# Altium project Memory_Expansion_Daughter_Board.PrjPCB (part 1 of 2)
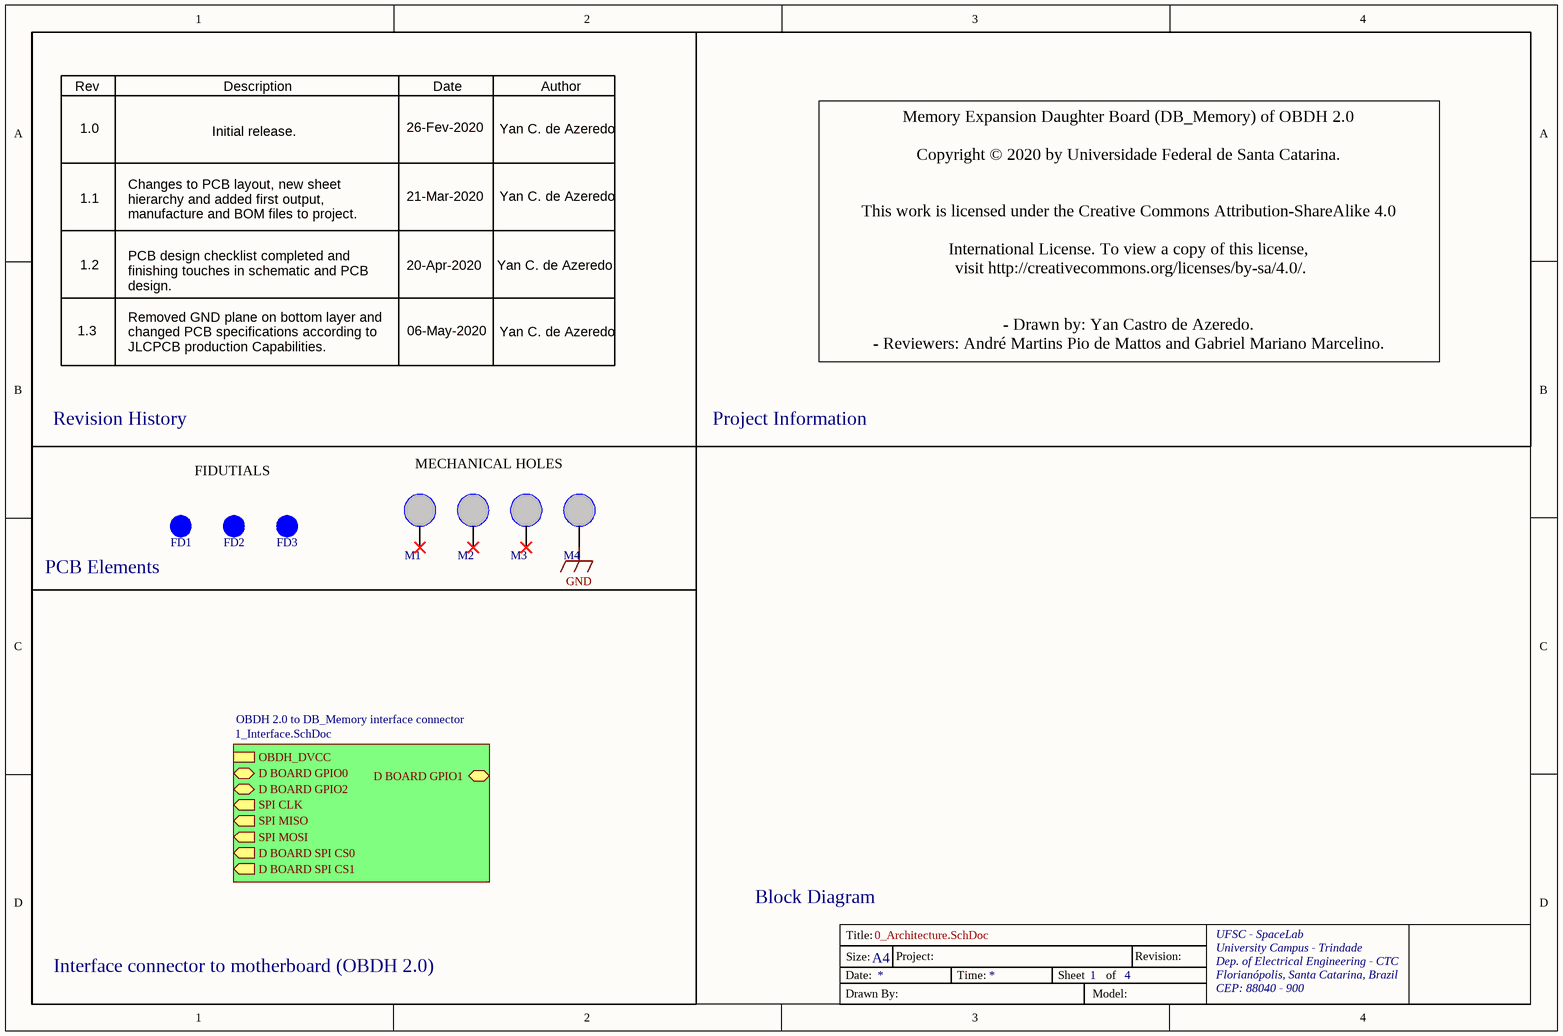
[diagram p0: 0_Architecture.SchDoc]
4 sheets, 45 parts. Net scope: hierarchical (ports join the sheet entries above them; power ports are global).
Board file: Memory_Expansion_Daughter_Board.PcbDoc
Sheets:
  0_Architecture.SchDoc
    OBDH 2.0 to DB_Memory interface connector = 1_Interface.SchDoc
      U_2_Non_Volatile_Memories = 2_Non_Volatile_Memories.SchDoc
      U_3_Communication_Buffers = 3_Communication_Buffers.SchDoc

## Sheet 0_Architecture.SchDoc
size A4; Organization: SpaceLab UFSC; Address1: UFSC - SpaceLab; Address2: University Campus - Trindade; Address3: Dep. of Electrical Engineering - CTC; Address4: Florianópolis, Santa Catarina, Brazil; DocumentNumber: 1; SheetNumber: 1; SheetTotal: 4; Address5: CEP: 88040 - 900

### Parts
FD1  Fiducial  [Fiducial 1.3mm]  (value not drawn)  (no BOM)
FD2  Fiducial  [Fiducial 1.3mm]  (value not drawn)  (no BOM)
FD3  Fiducial  [Fiducial 1.3mm]  (value not drawn)  (no BOM)
M1  DB Mechanical Hole  [DB Mechanical Hole]  (value not drawn)  (no BOM)
M2  DB Mechanical Hole  [DB Mechanical Hole]  (value not drawn)  (no BOM)
M3  DB Mechanical Hole  [DB Mechanical Hole]  (value not drawn)  (no BOM)
M4  DB Mechanical Hole  [DB Mechanical Hole]  (value not drawn)  (no BOM)

### Sub-sheets
OBDH 2.0 to DB_Memory interface connector = 1_Interface.SchDoc: OBDH_DVCC, D BOARD SPI CS1 (out), D BOARD SPI CS0 (out), SPI CLK (out), SPI MISO (out), D BOARD GPIO2 (bidir), D BOARD GPIO0 (bidir), SPI MOSI (out), D BOARD GPIO1 (bidir)

### Nets
GND: M4.0

Not connected (* = marked no-connect by the designer): M1 0*; M2 0*; M3 0*

### Notes on the sheet
- Rev
- Description
- Date
- Author
- 1.0
- Initial release.
- 26-Fev-2020
- Yan C. de Azeredo
- 1.1
- Changes to PCB layout, new sheet hierarchy and added first output, manufacture and BOM files to project.
- 21-Mar-2020
- 1.2
- PCB design checklist completed and finishing touches in schematic and PCB design.
- 20-Apr-2020
- 1.3
- Removed GND plane on bottom layer and changed PCB specifications according to JLCPCB production Capabilities.
- 06-May-2020
- Memory Expansion Daughter Board (DB_Memory) of OBDH 2.0
  Copyright © 2020 by Universidade Federal de Santa Catarina.
  This work is licensed under the Creative Commons Attribution-ShareAlike 4.0
  International License. To view a copy of this license,
  visit http://creativecommons.org/licenses/by-sa/4.0/.
  - Drawn by: Yan Castro de Azeredo.
  - Reviewers: André Martins Pio de Mattos and Gabriel Mariano Marcelino.
  - Based on OBDH 2.0 designed by: André Martins Pio de Mattos.
  - Support: Kleber Reis Gouveia Júnior.
- Revision History
- Project Information
- FIDUTIALS
- MECHANICAL HOLES
- (near FD1) PCB Elements
- Block Diagram
- Interface connector to motherboard (OBDH 2.0)
- Date:
- Title:
- Size:
- A4
- Project:
- Time:
- Sheet
- of
- Revision:
- UFSC - SpaceLab
- University Campus - Trindade
- Dep. of Electrical Engineering - CTC
- Florianópolis, Santa Catarina, Brazil
- CEP: 88040 - 900
- Drawn By:
- Model:

### Library data of the parts
FD1-FD3 = Fiducial: Fiducial for DB board variants
M1-M4 = DB Mechanical Hole: Mechanical Hole for DB board variants

## Sheet 1_Interface.SchDoc
size A4; Organization: SpaceLab UFSC; Address1: UFSC - SpaceLab; Address2: University Campus - Trindade; Address3: Dep. of Electrical Engineering - CTC; Address4: Florianópolis, Santa Catarina, Brazil; Address5: CEP: 88040 - 900
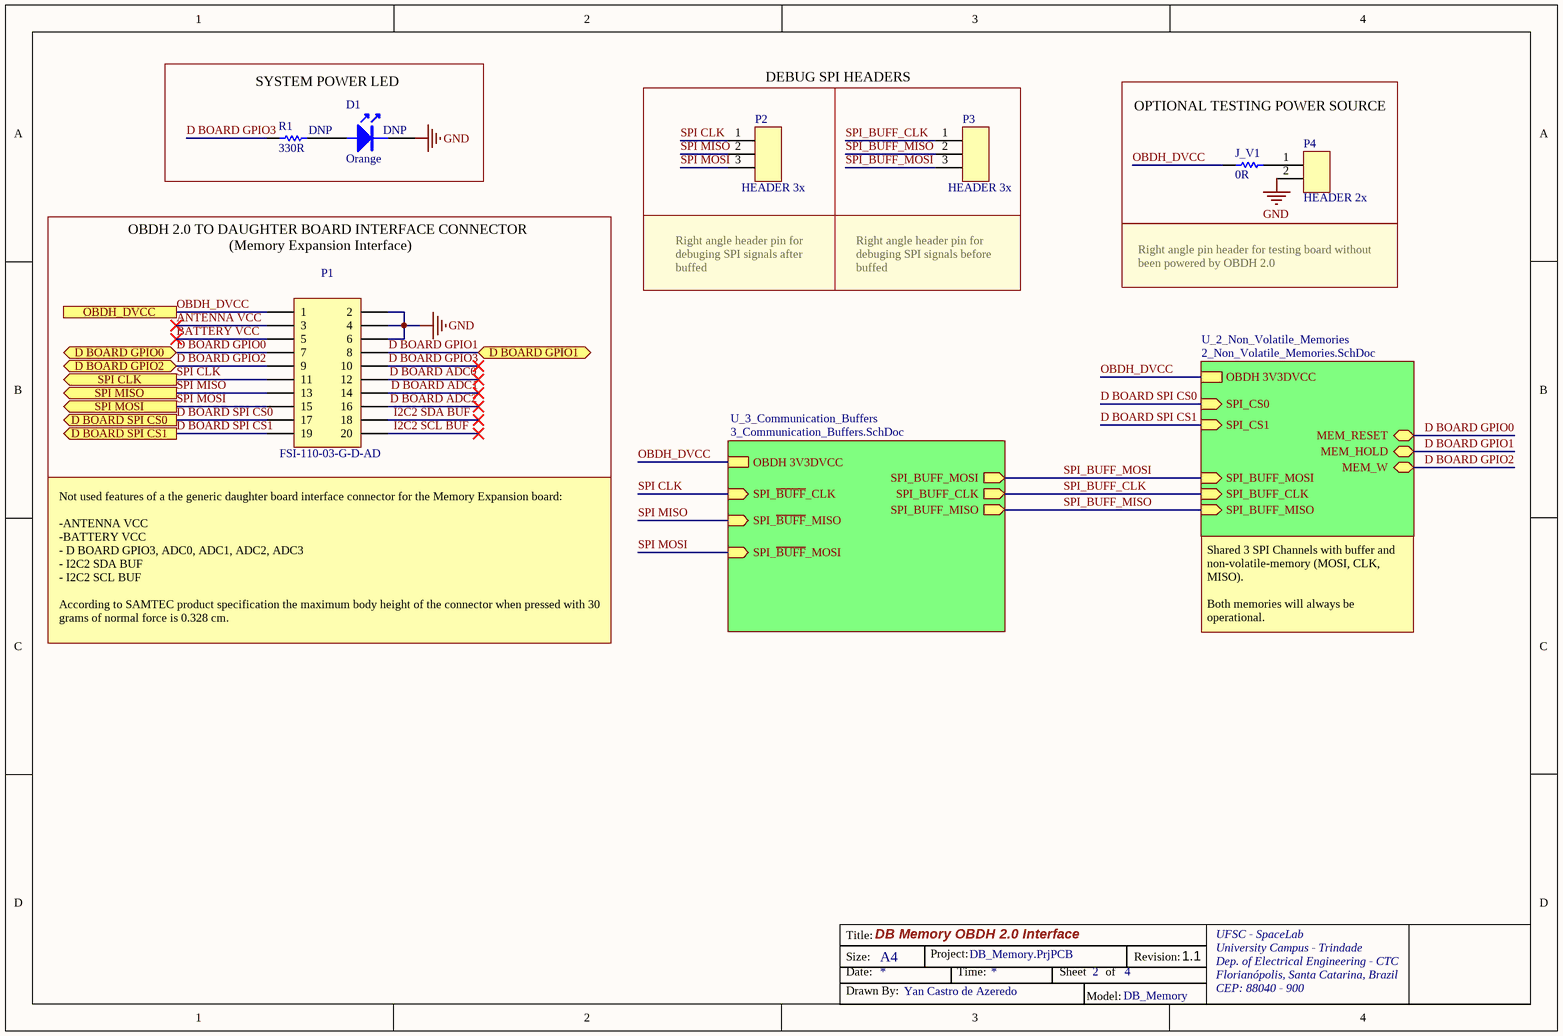
[diagram p1: 1_Interface.SchDoc]

### Parts
D1  Orange  [0805-LED]
J_V1  0R  [0805]
P1  FSI-110-03-G-D-AD  [Mating FSI-110-03-G-D-AD]
P2  HEADER 3x  [Header1x3]
P3  HEADER 3x  [Header1x3]
P4  HEADER 2x  [HEADER 1X2]
R1  330R  [0805]

### Blocks framed on the sheet
SYSTEM POWER LED: D1 R1
OPTIONAL TESTING POWER SOURCE: J_V1 P4
DEBUG SPI HEADERS: P2 P3

### Sub-sheets
U_2_Non_Volatile_Memories = 2_Non_Volatile_Memories.SchDoc: SPI_CS1 (in), SPI_CS0 (in), MEM_RESET (bidir), MEM_HOLD (bidir), MEM_W (bidir), SPI_BUFF_MOSI (in), SPI_BUFF_CLK (in), SPI_BUFF_MISO (in), OBDH 3V3DVCC
U_3_Communication_Buffers = 3_Communication_Buffers.SchDoc: SPI_BUFF_MOSI (out), SPI_BUFF_CLK (out), SPI_BUFF_MISO (out), SPI_~{BUFF}_MISO (in), SPI_~{BUFF}_CLK (in), SPI_~{BUFF}_MOSI (in), OBDH 3V3DVCC

### Ports
D BOARD GPIO0 (bidir), D BOARD GPIO1 (bidir), D BOARD GPIO2 (bidir), D BOARD SPI CS0 (out), D BOARD SPI CS1 (out), OBDH_DVCC, SPI CLK (out), SPI MISO (out), SPI MOSI (out)

### Nets
GND: D1.2(K) P1.2 P1.4 P1.6 P4.2
OBDH_DVCC: J_V1.2 P1.1 ; port OBDH_DVCC, sheet U_2_Non_Volatile_Memories/OBDH 3V3DVCC, sheet U_3_Communication_Buffers/OBDH 3V3DVCC  [project net OBDH 3V3DVCC]
ANTENNA VCC: P1.3
BATTERY VCC: P1.5
D BOARD ADC0: P1.12
D BOARD ADC1: P1.14
D BOARD ADC2: P1.16
D BOARD GPIO0: P1.7 ; port D BOARD GPIO0, sheet U_2_Non_Volatile_Memories/MEM_RESET
D BOARD GPIO1: P1.8 ; port D BOARD GPIO1, sheet U_2_Non_Volatile_Memories/MEM_HOLD
D BOARD GPIO2: P1.9 ; port D BOARD GPIO2, sheet U_2_Non_Volatile_Memories/MEM_W
D BOARD GPIO3: P1.10 R1.1
D BOARD SPI CS0: P1.17 ; port D BOARD SPI CS0, sheet U_2_Non_Volatile_Memories/SPI_CS0
D BOARD SPI CS1: P1.19 ; port D BOARD SPI CS1, sheet U_2_Non_Volatile_Memories/SPI_CS1
I2C2 SCL BUF: P1.20
I2C2 SDA BUF: P1.18
SPI CLK: P1.11 P2.1 ; port SPI CLK, sheet U_3_Communication_Buffers/SPI_~{BUFF}_CLK
SPI MISO: P1.13 P2.2 ; port SPI MISO, sheet U_3_Communication_Buffers/SPI_~{BUFF}_MISO
SPI MOSI: P1.15 P2.3 ; port SPI MOSI, sheet U_3_Communication_Buffers/SPI_~{BUFF}_MOSI
SPI_BUFF_CLK: P3.1 ; sheet U_2_Non_Volatile_Memories/SPI_BUFF_CLK, sheet U_3_Communication_Buffers/SPI_BUFF_CLK
SPI_BUFF_MISO: P3.2 ; sheet U_2_Non_Volatile_Memories/SPI_BUFF_MISO, sheet U_3_Communication_Buffers/SPI_BUFF_MISO
SPI_BUFF_MOSI: P3.3 ; sheet U_2_Non_Volatile_Memories/SPI_BUFF_MOSI, sheet U_3_Communication_Buffers/SPI_BUFF_MOSI
NetD1_1: D1.1(A) R1.2
NetJ_V1_1: J_V1.1 P4.1

### Notes on the sheet
- (near R1) DNP
- (near D1) DNP
- OBDH 2.0 TO DAUGHTER BOARD INTERFACE CONNECTOR
- (Memory Expansion Interface)
- Right angle header pin for debuging SPI signals after buffed
- Right angle header pin for debuging SPI signals before buffed
- Right angle pin header for testing board without been powered by OBDH 2.0
- Not used features of a the generic daughter board interface connector for the Memory Expansion board:
  -ANTENNA VCC
  -BATTERY VCC
  - D BOARD GPIO3, ADC0, ADC1, ADC2, ADC3
  - I2C2 SDA BUF
  - I2C2 SCL BUF
  According to SAMTEC product specification the maximum body height of the connector when pressed with 30 grams of normal force is 0.328 cm.
- Shared 3 SPI Channels with buffer and non-volatile-memory (MOSI, CLK, MISO).
  Both memories will always be operational.
- DB Memory OBDH 2.0 Interface
- DB_Memory.PrjPCB
- 2
- 4
- 1.1
- Yan Castro de Azeredo
- DB_Memory
- Title:
- Size:
- Date:
- A4
- Project:
- Time:
- Sheet
- of
- Revision:
- UFSC - SpaceLab
- University Campus - Trindade
- Dep. of Electrical Engineering - CTC
- Florianópolis, Santa Catarina, Brazil
- CEP: 88040 - 900
- Drawn By:
- Model:

### Library data of the parts
D1 = LED/O_0802: SMD Orange LED; Partnumber: LTST-C170KFKT; Manufacturer: Vishay Lite-On; Dominant Wavelength: 605nm; Forward Current: 30mA; Forward Voltage: 2V; Lens Color: Colorless; Lens Style: Diffused,Colorless,Rectangular,Clear; Lens Transparency: Clear; Luminous Intensity: 60mcd; Number of Elements: 1; Power Dissipation: 75mW; Reverse Voltage: 5V; Test Current: 20mA; Viewing Angle: 130°; Wavelength: 611nm; NCM: 8541.40.21; ComponentLink1Description: https://www.digikey.com/product-detail/en/lite-on-inc/LTST-C170KFKT/160-1413-1-ND/386774; ComponentLink1URL: https://www.digikey.com/product-detail/en/lite-on-inc/LTST-C170KFKT/160-1413-1-ND/386774; ComponentLink2Description: https://br.mouser.com/ProductDetail/Lite-On/LTST-C170KFKT?qs=%2Fha2pyFadugHsX7bdQzWjMrioqtf8F%2FEFUVxYkqdVx%252BrRWuVMVludQ%3D%3D; ComponentLink2URL: https://br.mouser.com/ProductDetail/Lite-On/LTST-C170KFKT?qs=%2Fha2pyFadugHsX7bdQzWjMrioqtf8F%2FEFUVxYkqdVx%252BrRWuVMVludQ%3D%3D; Case/Package: 0805; Case Code (Imperial): 0805; Case Code (Metric): 2012; Color: Orange; ComponentLink3Description: https://www.verical.com/server-webapp/html/getDatasheet?partID=158266&src-supplier=Verical; ComponentLink3URL: https://www.verical.com/server-webapp/html/getDatasheet?partID=158266&src-supplier=Verical; ComponentLink4Description: http://optoelectronics.liteon.com/upload/download/DS-22-99-0185/LTST-C170KFKT.pdf?src-supplier=Digi-Key; ComponentLink4URL: http://optoelectronics.liteon.com/upload/download/DS-22-99-0185/LTST-C170KFKT.pdf?src-supplier=Digi-Key; ComponentLink5Description: http://www1.futureelectronics.com/doc/LITE-ON/LTST-C170KFKT.pdf?src-supplier=Future+Electronics; ComponentLink5URL: http://www1.futureelectronics.com/doc/LITE-ON/LTST-C170KFKT.pdf?src-supplier=Future+Electronics; ComponentLink6Description: http://www.mouser.com/ds/2/239/Lite-On-LTST-C170KFKT-187690.pdf?src-supplier=Mouser; ComponentLink6URL: http://www.mouser.com/ds/2/239/Lite-On-LTST-C170KFKT-187690.pdf?src-supplier=Mouser; Depth: 1.6mm; Height: 1.1mm; Illumination Color: Orange; Lead Free: Lead Free; Length: 3.2mm; Manufacturer Part Number: LTST-C170KFKT; Max Operating Temperature: 85°C; Min Operating Temperature: -55°C; Mount: Surface Mount; Number of LEDs: 1; Number of Pins: 2; Package Quantity: 1; Packaging: Tape and Reel; Power Rating: 75mW; Pricing 1: 1=0.28, 10=0.204, 100=0.0968, 500=0.0645, 1000=0.05053 (USD); Pricing 2: 1=0.28, 10=0.15, 100=0.07, 1000=0.051, 3000=0.043, 9000=0.039, 24000=0.035, 45000=0.032, 99000=0.03 (USD); Radiation Hardening: No; Stock 1: 5261; Stock 2: 0; Supplier 1: Digi-Key; Supplier 2: Mouser; Supplier Part Number 1: 160-1413-1-ND; Supplier Part Number 2: 859-LTST-C170KFKT; Width: 1.25mm
J_V1 = RC0805JR-070RL: RES 0R OHM 1/8W JUMPER 0805; Partnumber: CRCW08050000Z0EA; Manufacturer: Yageo; Resistance: 0mR; Tolerance: 5%; Power Rating: 125mW; Voltage Rating: 150V; Temperature Coefficient: 200ppm/°C; NCM: 8533.21.20; Supplier 1: Digi-Key; Supplier Part Number 1: 311-0.0ARCT-ND; Stock 1: 10579520; Pricing 1: 1=0.1, 10=0.035, 25=0.0248, 50=0.019, 100=0.014, 250=0.01072, 500=0.00856, 1000=0.00631 (USD); Case/Package: 0805; Number of Pins: 2; Contact Plating: Tin,Matte; Case Code (Imperial): 0805; Case Code (Metric): 2012; Min Operating Temperature: -55°C; Max Operating Temperature: 155°C; Composition: Thick Film; Packaging: Tape and Reel; Voltage Rating (DC): 150V; Termination: SMD/SMT; Military Standard: Not; Length: 2mm; Height: 0.5mm; Width: 1.25mm; Depth: 1.25mm; Radiation Hardening: No; REACH SVHC: Unknown; Lead Free: Lead Free; ComponentLink1URL: http://www.farnell.com/datasheets/2167052.pdf?src-supplier=Element14; ComponentLink1Description: http://www.farnell.com/datasheets/2167052.pdf?src-supplier=Element14; ComponentLink2URL: http://documents.rs-components.com/techlib://itc_doclist_GB.htm?stockno=6185129&src-supplier=RSComponents; ComponentLink2Description: http://documents.rs-components.com/techlib://itc_doclist_GB.htm?stockno=6185129&src-supplier=RSComponents; ComponentLink3URL: https://www.verical.com/server-webapp/html/getDatasheet?partID=330685&src-supplier=Verical; ComponentLink3Description: https://www.verical.com/server-webapp/html/getDatasheet?partID=330685&src-supplier=Verical; Supplier 2: Mouser; Supplier Part Number 2: 603-RC0805JR-070RL; Stock 2: 658275; Pricing 2: 1=0.1, 10=0.005, 100=0.005, 1000=0.005, 5000=0.004, 10000=0.004 (USD); Manufacturer Part Number: RC0805JR-070RL
P1 = FSI-110-03-G-D-AD: CONN STACKING 20POS SMD GOLD; Manufacturer: Samtec; Gender: Male; Number of Contacts: 20; Pitch: 1mm; Value: *; Partnumber: FSI-110-03-G-D-AD; ComponentLink1Description: https://www.digikey.com/product-detail/en/samtec-inc/FSI-110-03-G-D-AD/SAM9412-ND/6678149; ComponentLink1URL: https://www.digikey.com/product-detail/en/samtec-inc/FSI-110-03-G-D-AD/SAM9412-ND/6678149; ComponentLink2Description: https://br.mouser.com/ProductDetail/Samtec/FSI-110-03-G-D-AD?qs=sGAEpiMZZMvffgRu4KC1RxM6nKwEP14AvPoIU%2FGiIRnIunfAN0MvNQ%3D%3D; ComponentLink2URL: https://br.mouser.com/ProductDetail/Samtec/FSI-110-03-G-D-AD?qs=sGAEpiMZZMvffgRu4KC1RxM6nKwEP14AvPoIU%2FGiIRnIunfAN0MvNQ%3D%3D; ComponentLink3Description: http://www.samtec.com/ftppub/pdf/FSI_03.PDF?src-supplier=Avnet+Europe; ComponentLink3URL: http://www.samtec.com/ftppub/pdf/FSI_03.PDF?src-supplier=Avnet+Europe; Contact Material: Copper; Contact Plating: Gold; Manufacturer Part Number: FSI-110-03-G-D-AD; Mount: Surface Mount; Number of Rows: 2; Pricing 1: 1=6.6, 10=6.325, 25=5.7752, 50=5.5, 100=5.225, 250=4.675, 500=4.4, 1000=3.85, 2500=3.6575 (USD); Pricing 2: 1=6.59, 10=5.5, 100=4.68, 250=4.17, 500=3.84, 1000=3.6 (USD); Radiation Hardening: No; REACH SVHC: No SVHC; Stock 1: 100; Stock 2: 50; Supplier 1: Digi-Key; Supplier 2: Mouser; Supplier Part Number 1: SAM9412-ND; Supplier Part Number 2: 200-FSI11003GDAD; Termination: Solder
P2 P3 = HEADER 3x: Conn Unshrouded Header HDR 3 POS 2.54mm Solder RA Thru-Hole Automotive Bulk; Manufacturer: Samtec; Manufacturer Part Number: TSW-103-08-G-S-RA; Number of Contacts: 3; Connector Type: Male Pin; Gender: Male; Max Current Rating: 7.6A; Max Voltage Rating (AC): 450V; Supplier 1: Digi-Key; Stock 1: 2099; Pricing 1: 1=0.43, 10=0.403, 25=0.3456, 50=0.2938, 100=0.2822, 250=0.25344, 500=0.24192 (USD); Contact Plating: Gold; Contact Material: Bronze; Color: Black; Housing Color: Black; Housing Material: Polyester; Min Operating Temperature: -55°C; Max Operating Temperature: 125°C; Number of Rows: 1; Termination: Solder; Packaging: Bulk; Number of Positions: 3; Package Quantity: 1; Orientation: Right Angle; Length: 7.62mm; Pitch: 2.54mm; Depth: 9.9mm; Contact Mating Length: 0.23inch; Width: 2.54mm; Radiation Hardening: No; REACH SVHC: No SVHC; Lead Free: Lead Free; Supplier Part Number 1: SAM1039-03-ND; ComponentLink4Description: https://www.digikey.com/product-detail/en/samtec-inc/TSW-103-08-G-S-RA/SAM1039-03-ND/1101821; ComponentLink4URL: https://www.digikey.com/product-detail/en/samtec-inc/TSW-103-08-G-S-RA/SAM1039-03-ND/1101821; ComponentLink5Description: https://br.mouser.com/ProductDetail/Samtec/TSW-103-08-G-S-RA?qs=sGAEpiMZZMs%252BGHln7q6pm1g2HIpDMMemHovqpYNR5zQ9xV6Y7S0zpg%3D%3D; ComponentLink5URL: https://br.mouser.com/ProductDetail/Samtec/TSW-103-08-G-S-RA?qs=sGAEpiMZZMs%252BGHln7q6pm1g2HIpDMMemHovqpYNR5zQ9xV6Y7S0zpg%3D%3D; ComponentLink1URL: http://www.samtec.com/ftppub/pdf/htsw_th.pdf?src-supplier=Avnet+Europe; ComponentLink1Description: http://www.samtec.com/ftppub/pdf/htsw_th.pdf?src-supplier=Avnet+Europe; ComponentLink2URL: http://www.samtec.com/ftppub/pdf/htsw_th.pdf?src-supplier=Avnet; ComponentLink2Description: http://www.samtec.com/ftppub/pdf/htsw_th.pdf?src-supplier=Avnet; ComponentLink3URL: http://suddendocs.samtec.com/prints/tsw-xxx-xx-x-x-xx-xxx-footprint.pdf?src-supplier=Digi-Key; ComponentLink3Description: http://suddendocs.samtec.com/prints/tsw-xxx-xx-x-x-xx-xxx-footprint.pdf?src-supplier=Digi-Key; Supplier 2: Mouser; Supplier Part Number 2: 200-TSW10308GSRA; Stock 2: 1859; Pricing 2: 1=0.44, 10=0.303, 100=0.249, 1000=0.208, 2500=0.178, 10000=0.16 (USD)
P4 = HEADER 2x: Conn Unshrouded Header HDR 2 POS 2.54mm Solder RA Thru-Hole Automotive Bulk; Manufacturer: Samtec; Manufacturer Part Number: TSW-102-08-G-S-RA; Number of Positions: 2; Connector Type: Male Pin; Gender: Male; Max Current Rating: 7.6A; Max Voltage Rating (AC): 450V; Supplier 1: Digi-Key; Stock 1: 681; Pricing 1: 1=0.28, 10=0.269, 25=0.2304, 50=0.1958, 100=0.1882, 250=0.16896, 500=0.16128 (USD); Contact Plating: Gold; Contact Material: Bronze; Color: Black; Housing Color: Black; Housing Material: Polyester; Min Operating Temperature: -55°C; Max Operating Temperature: 125°C; Number of Rows: 1; Termination: Solder; Packaging: Bulk; Number of Contacts: 2; Orientation: Right Angle; Package Quantity: 1; Length: 5.08mm; Pitch: 2.54mm; Width: 2.54mm; Depth: 9.9mm; Contact Mating Length: 0.23inch; Radiation Hardening: No; Lead Free: Lead Free; REACH SVHC: No SVHC; ComponentLink1URL: http://www.samtec.com/ftppub/pdf/htsw_th.pdf?src-supplier=Avnet; ComponentLink1Description: http://www.samtec.com/ftppub/pdf/htsw_th.pdf?src-supplier=Avnet; ComponentLink2URL: http://suddendocs.samtec.com/prints/tsw-xxx-xx-x-x-xx-xxx-footprint.pdf?src-supplier=Digi-Key; ComponentLink2Description: http://suddendocs.samtec.com/prints/tsw-xxx-xx-x-x-xx-xxx-footprint.pdf?src-supplier=Digi-Key; Supplier Part Number 1: SAM1039-02-ND; ComponentLink3Description: https://www.digikey.com/product-detail/en/samtec-inc/TSW-102-08-G-S-RA/SAM1039-02-ND/1101822; ComponentLink3URL: https://www.digikey.com/product-detail/en/samtec-inc/TSW-102-08-G-S-RA/SAM1039-02-ND/1101822; ComponentLink4Description: https://br.mouser.com/ProductDetail/Samtec/TSW-102-08-G-S-RA?qs=sGAEpiMZZMs%252BGHln7q6pm8Vn94ktop%2FJ1uezLg%252BX1dFCcXJp94NfRw%3D%3D; ComponentLink4URL: https://br.mouser.com/ProductDetail/Samtec/TSW-102-08-G-S-RA?qs=sGAEpiMZZMs%252BGHln7q6pm8Vn94ktop%2FJ1uezLg%252BX1dFCcXJp94NfRw%3D%3D; Pricing 2: 1=0.29, 10=0.203, 100=0.167, 1000=0.14, 2500=0.119, 10000=0.108 (USD); Stock 2: 90; Supplier 2: Mouser; Supplier Part Number 2: 200-TSW10208GSRA
R1 = R330R_1%_1/4W_0805: RES 330R OHM 1/4W 1% 0805; Partnumber: RC0805FR-07330RL; Manufacturer: KOA Speer; Manufacturer Part Number: RK73H2ATTD3300F; Power Rating: 125mW; Temperature Coefficient: 100ppm/°C; Voltage Rating: 150V; NCM: 8533.21.20; Case/Package: 0805; Case Code (Imperial): 0805; Case Code (Metric): 2012; ComponentLink1Description: https://www.digikey.com/product-detail/en/koa-speer-electronics-inc/RK73H2ATTD3300F/2019-RK73H2ATTD3300FCT-ND/10235463; ComponentLink1URL: https://www.digikey.com/product-detail/en/koa-speer-electronics-inc/RK73H2ATTD3300F/2019-RK73H2ATTD3300FCT-ND/10235463; ComponentLink2Description: https://br.mouser.com/ProductDetail/KOA-Speer/RK73H2ATTD3300F?qs=%2Fha2pyFadugxRkEvlrt8CF%252BQdweyO24kpRel1WKIEPxDUp0ygGBU5A%3D%3D; ComponentLink2URL: https://br.mouser.com/ProductDetail/KOA-Speer/RK73H2ATTD3300F?qs=%2Fha2pyFadugxRkEvlrt8CF%252BQdweyO24kpRel1WKIEPxDUp0ygGBU5A%3D%3D; ComponentLink3Description: http://www.koaspeer.com/catimages/Products/RK73H/RK73H.pdf?src-supplier=Mouser; ComponentLink3URL: http://www.koaspeer.com/catimages/Products/RK73H/RK73H.pdf?src-supplier=Mouser; ComponentLink4Description: http://www.farnell.com/datasheets/1832268.pdf?src-supplier=Element14; ComponentLink4URL: http://www.farnell.com/datasheets/1832268.pdf?src-supplier=Element14; Composition: Thick Film; Depth: 1.25mm; Height: 0.5mm; Lead Free: Lead Free; Length: 2mm; Max Operating Temperature: 155°C; Military Standard: Not; Min Operating Temperature: -55°C; Package Quantity: 5000; Packaging: Tape and Reel; Pricing 1: 1=0.1, 10=0.033, 100=0.0136, 1000=0.00612, 2500=0.00531 (USD); Pricing 2: 1=0.1, 10=0.033, 100=0.013, 1000=0.005, 5000=0.005, 10000=0.004 (USD); REACH SVHC: Unknown; Resistance: 330R; Stock 1: 55895; Stock 2: 0; Supplier 1: Digi-Key; Supplier 2: Mouser; Supplier Part Number 1: 2019-RK73H2ATTD3300FCT-ND; Supplier Part Number 2: 660-RK73H2ATTD3300F; Termination: SMD/SMT; Tolerance: 1%; Width: 1.25mm

## Sheet 2_Non_Volatile_Memories.SchDoc
size A4; Organization: SpaceLab UFSC; Address1: UFSC - SpaceLab; Address2: University Campus - Trindade; Address3: Dep. of Electrical Engineering - CTC; Address4: Florianópolis, Santa Catarina, Brazil; DocumentNumber: 3; SheetNumber: 3; SheetTotal: 4; Address5: CEP: 88040 - 900
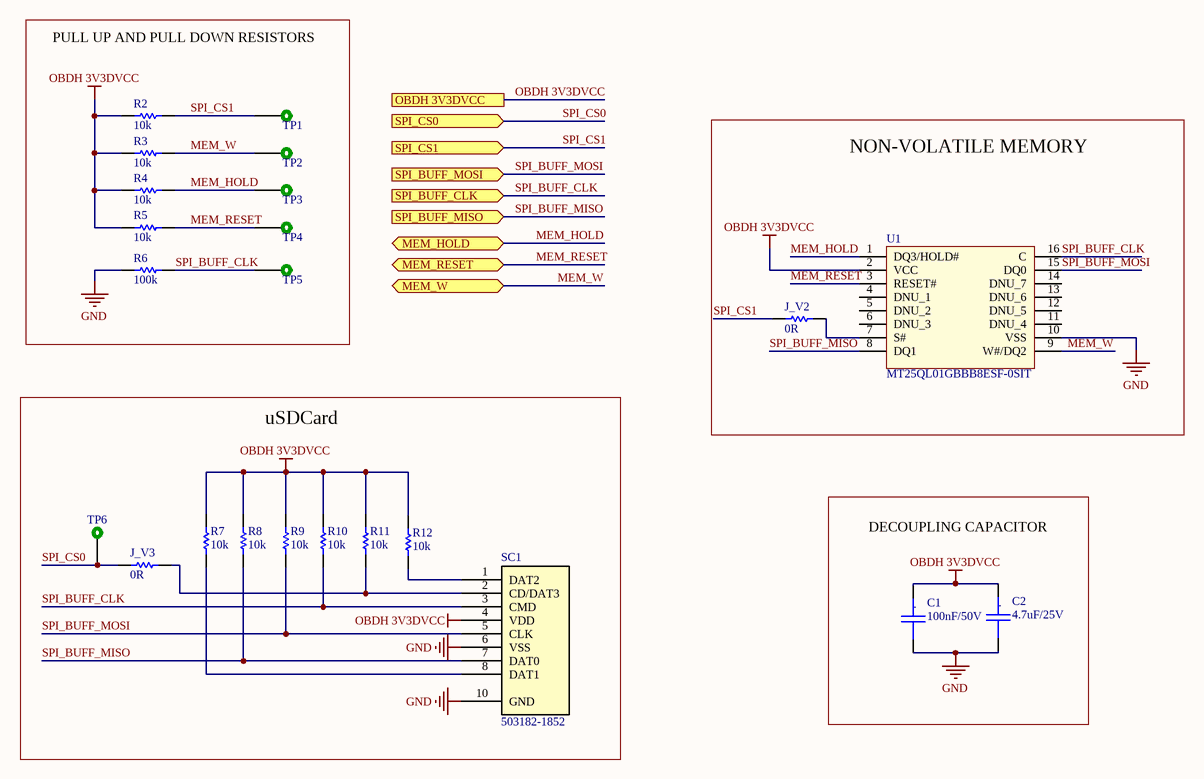
[diagram p2: 2_Non_Volatile_Memories.SchDoc]

### Parts
C1  100nF/50V  [C0603_MD]
C2  4.7uF/25V  [C0805_MD]
J_V2  0R  [0805]
J_V3  0R  [0805]
R2  10k  [0805]
R3  10k  [0805]
R4  10k  [0805]
R5  10k  [0805]
R6  100k  [0805]
R7  10k  [0805]
R8  10k  [0805]
R9  10k  [0805]
R10  10k  [0805]
R11  10k  [0805]
R12  10k  [0805]
SC1  MicroSD Card Connector  [USD_CARD]  (value not drawn)
TP1  TEST_POINT_2  [TEST_POINT_2]  (value not drawn)  (no BOM)
TP2  TEST_POINT_2  [TEST_POINT_2]  (value not drawn)  (no BOM)
TP3  TEST_POINT_2  [TEST_POINT_2]  (value not drawn)  (no BOM)
TP4  TEST_POINT_2  [TEST_POINT_2]  (value not drawn)  (no BOM)
TP5  TEST_POINT_2  [TEST_POINT_2]  (value not drawn)  (no BOM)
TP6  TEST_POINT_2  [TEST_POINT_2]  (value not drawn)  (no BOM)
U1  MT25QL01GBBB8ESF-0SIT  [SOIC127P1032X265-16N]

### Blocks framed on the sheet
PULL UP AND PULL DOWN RESISTORS: R2-R6 TP1-TP5
NON-VOLATILE MEMORY: J_V2 U1
uSDCard: J_V3 R7-R12 SC1 TP6
DECOUPLING CAPACITOR: C1 C2

### Ports
MEM_HOLD (bidir), MEM_RESET (bidir), MEM_W (bidir), OBDH 3V3DVCC, SPI_BUFF_CLK (in), SPI_BUFF_MISO (in), SPI_BUFF_MOSI (in), SPI_CS0 (in), SPI_CS1 (in)

### Nets
GND: C1.2 C2.2 R6.2 SC1.6(VSS) SC1.10(GND) U1.10(VSS)
OBDH 3V3DVCC: C1.1 C2.1 R2.2 R3.2 R4.2 R5.2 R7.2 R8.2 R9.2 R10.2 R11.2 R12.2 SC1.4(VDD) U1.2(VCC) ; port OBDH 3V3DVCC
MEM_HOLD: R4.1 TP3.1 U1.1(DQ3/HOLD#) ; port MEM_HOLD  [project net D BOARD GPIO1]
MEM_RESET: R5.1 TP4.1 U1.3(RESET#) ; port MEM_RESET  [project net D BOARD GPIO0]
MEM_W: R3.1 TP2.1 U1.9(W#/DQ2) ; port MEM_W  [project net D BOARD GPIO2]
SPI_BUFF_CLK: R6.1 R10.1 SC1.3(CMD) TP5.1 U1.16(C) ; port SPI_BUFF_CLK
SPI_BUFF_MISO: R8.1 SC1.7(DAT0) U1.8(DQ1) ; port SPI_BUFF_MISO
SPI_BUFF_MOSI: R9.1 SC1.5(CLK) U1.15(DQ0) ; port SPI_BUFF_MOSI
SPI_CS0: J_V3.2 TP6.1 ; port SPI_CS0  [project net D BOARD SPI CS0]
SPI_CS1: J_V2.2 R2.1 TP1.1 ; port SPI_CS1  [project net D BOARD SPI CS1]
NetJ_V2_1: J_V2.1 U1.7(S#)
NetJ_V3_1: J_V3.1 R11.1 SC1.2(CD/DAT3)
NetR7_1: R7.1 SC1.8(DAT1)
NetR12_1: R12.1 SC1.1(DAT2)

Not connected (* = marked no-connect by the designer): U1 4(DNU_1) 5(DNU_2) 6(DNU_3) 11(DNU_4) 12(DNU_5) 13(DNU_6) 14(DNU_7)

### Notes on the sheet
- Date:
- Title:
- Size:
- A4
- Project:
- Time:
- Sheet
- of
- Revision:
- UFSC - SpaceLab
- University Campus - Trindade
- Dep. of Electrical Engineering - CTC
- Florianópolis, Santa Catarina, Brazil
- CEP: 88040 - 900
- Drawn By:
- Model:
- (in symbol Cap_Cer_X7R_4.7uF_25V_0805) .
- (in symbol Cap_Cer_X7R_100nF_50V_0603) .

### Library data of the parts
C1 = Cap_Cer_X7R_100nF_50V_0603: CAP CER 100nF 50V 0603 10%; Partnumber: C0603C104K5RAC3121; Manufacturer: Yageo; Manufacturer Part Number: CC0201KRX7R9BB101; Capacitance: 100pF; Dielectric: X7R; NCM: 8532.24.10; Case/Package: 0201; Case Code (Imperial): 0201; Case Code (Metric): 0603; ComponentLink1Description: https://www.digikey.com/product-detail/en/yageo/CC0201KRX7R9BB101/311-1401-1-ND/2833707; ComponentLink1URL: https://www.digikey.com/product-detail/en/yageo/CC0201KRX7R9BB101/311-1401-1-ND/2833707; ComponentLink2Description: https://br.mouser.com/ProductDetail/Yageo/CC0201KRX7R9BB101?qs=%2Fha2pyFaduiYipKOFrxfqt3%252B9aGSfhofiweIoBBppi5CkwQHqUahpQ%3D%3D; ComponentLink2URL: https://br.mouser.com/ProductDetail/Yageo/CC0201KRX7R9BB101?qs=%2Fha2pyFaduiYipKOFrxfqt3%252B9aGSfhofiweIoBBppi5CkwQHqUahpQ%3D%3D; ComponentLink3Description: http://www.yageo.com/documents/recent/UPY-GPHC_X7R_6.3V-to-50V_18.pdf?src-supplier=Digi-Key; ComponentLink3URL: http://www.yageo.com/documents/recent/UPY-GPHC_X7R_6.3V-to-50V_18.pdf?src-supplier=Digi-Key; ComponentLink4Description: http://www.yageo.com/documents/recent/UPY-GPHC_X7R_6.3V-to-50V_8.pdf?src-supplier=Avnet+Europe; ComponentLink4URL: http://www.yageo.com/documents/recent/UPY-GPHC_X7R_6.3V-to-50V_8.pdf?src-supplier=Avnet+Europe; ComponentLink5Description: http://www.yageo.com/documents/recent/UPY-GPHC_X7R_6.3V-to-50V_8.pdf?src-supplier=Avnet; ComponentLink5URL: http://www.yageo.com/documents/recent/UPY-GPHC_X7R_6.3V-to-50V_8.pdf?src-supplier=Avnet; ComponentLink6Description: http://www.mouser.com/ds/2/447/Yageo_UPY-GP_NP0_16V-to-50V_9-358835.pdf?src-supplier=Mouser; ComponentLink6URL: http://www.mouser.com/ds/2/447/Yageo_UPY-GP_NP0_16V-to-50V_9-358835.pdf?src-supplier=Mouser; Composition: Ceramic; Depth: 0.3mm; Halogen Free: Halogen Free; Height: 0.3mm; Lead Free: Lead Free; Length: 0.6mm; Max Operating Temperature: 125°C; Min Operating Temperature: -55°C; Mount: Surface Mount; Package Quantity: 1; Packaging: Tape and Reel; Pricing 1: 1=0.1, 10=0.017, 100=0.0078, 500=0.00554, 1000=0.00436, 2500=0.00396, 5000=0.00364 (USD); Pricing 2: 1=0.1, 10=0.024, 100=0.011, 1000=0.009, 2500=0.006, 10000=0.006 (USD); Radiation Hardening: No; Stock 1: 203642; Stock 2: 51204; Supplier 1: Digi-Key; Supplier 2: Mouser; Supplier Part Number 1: 311-1401-1-ND; Supplier Part Number 2: 603-CC201KRX7R9BB101; Termination: SMD/SMT; Thickness: 0.013inch; Tolerance: 10%; Voltage Rating (DC): 50V; Voltage Rating: 50V; Weight: 6E-06oz; Width: 0.012inch
C2 = Cap_Cer_X7R_4.7uF_25V_0805: CAP CER 4.7UF 25V 10% X7R 0805; Partnumber: C0805C475K3RACAUTO; Manufacturer: Taiyo Yuden; Manufacturer Part Number: TMK212AB7475KG-T; NCM: 8532.24.10; Capacitance: 4.7uF; Case/Package: 0805; Case Code (Imperial): 0805; Case Code (Metric): 2012; ComponentLink1Description: https://www.digikey.com/product-detail/en/taiyo-yuden/TMK212AB7475KG-T/587-2990-2-ND/2714168; ComponentLink1URL: https://www.digikey.com/product-detail/en/taiyo-yuden/TMK212AB7475KG-T/587-2990-2-ND/2714168; ComponentLink2Description: https://br.mouser.com/ProductDetail/Taiyo-Yuden/TMK212AB7475KG-T?qs=%2Fha2pyFaduhOmvqoBXaf2AOtUPA8upoo0e72F1hCYb1lacT8UkHI0g%3D%3D; ComponentLink2URL: https://br.mouser.com/ProductDetail/Taiyo-Yuden/TMK212AB7475KG-T?qs=%2Fha2pyFaduhOmvqoBXaf2AOtUPA8upoo0e72F1hCYb1lacT8UkHI0g%3D%3D; ComponentLink3Description: https://www.yuden.co.jp/productdata/catalog/mlcc_all_e.pdf?src-supplier=Digi-Key; ComponentLink3URL: https://www.yuden.co.jp/productdata/catalog/mlcc_all_e.pdf?src-supplier=Digi-Key; ComponentLink4Description: http://www.yuden.co.jp/ut/product/category/capacitor/TMK212AB7475KG-T.pdf?src-supplier=Avnet; ComponentLink4URL: http://www.yuden.co.jp/ut/product/category/capacitor/TMK212AB7475KG-T.pdf?src-supplier=Avnet; ComponentLink5Description: http://www.farnell.com/datasheets/1481447.pdf?src-supplier=Element14; ComponentLink5URL: http://www.farnell.com/datasheets/1481447.pdf?src-supplier=Element14; ComponentLink6Description: http://www.onlinecomponents.com/productFiles/mf-TAI/461tmk212ab7475kg-t.pdf?src-supplier=Onlinecomponents.com; ComponentLink6URL: http://www.onlinecomponents.com/productFiles/mf-TAI/461tmk212ab7475kg-t.pdf?src-supplier=Onlinecomponents.com; Composition: Ceramic; Depth: 1.25mm; Dielectric: X7R; Height: 1.25mm; Length: 2mm; Max Operating Temperature: 125°C; Min Operating Temperature: -55°C; Mount: Surface Mount; Number of Pins: 2; Package Quantity: 1; Packaging: Tape and Reel; Pricing 1: 1=0.35, 10=0.243, 100=0.1376, 500=0.09716, 1000=0.08501 (USD); Pricing 2: 1=0.27, 10=0.124, 100=0.083, 500=0.074, 1000=0.065, 3000=0.054 (USD); Radiation Hardening: No; REACH SVHC: Unknown; Stock 1: 1594936; Stock 2: 326053; Supplier 1: Digi-Key; Supplier 2: Mouser; Supplier Part Number 1: 587-2990-6-ND; Supplier Part Number 2: 963-TMK212AB7475KG-T; Termination: SMD/SMT; Thickness: 0.053inch; Tolerance: 10%; Voltage Rating (DC): 25V; Voltage Rating: 25V; Width: 0.049inch
J_V2 J_V3 = RC0805JR-070RL: as J_V1 on sheet 1_Interface; NCM: 8533.21.20; Supplier 1: Digi-Key; Supplier Part Number 1: 311-0.0ARCT-ND; Stock 1: 10579520; Pricing 1: 1=0.1, 10=0.035, 25=0.0248, 50=0.019, 100=0.014, 250=0.01072, 500=0.00856, 1000=0.00631 (USD); Case/Package: 0805; Number of Pins: 2; Contact Plating: Tin,Matte; Case Code (Imperial): 0805; Case Code (Metric): 2012; Min Operating Temperature: -55°C; Max Operating Temperature: 155°C; Composition: Thick Film; Packaging: Tape and Reel; Voltage Rating (DC): 150V; Termination: SMD/SMT; Military Standard: Not; Length: 2mm; Height: 0.5mm; Width: 1.25mm; Depth: 1.25mm; Radiation Hardening: No; REACH SVHC: Unknown; Lead Free: Lead Free; ComponentLink1URL: http://www.farnell.com/datasheets/2167052.pdf?src-supplier=Element14; ComponentLink1Description: http://www.farnell.com/datasheets/2167052.pdf?src-supplier=Element14; ComponentLink2URL: http://documents.rs-components.com/techlib://itc_doclist_GB.htm?stockno=6185129&src-supplier=RSComponents; ComponentLink2Description: http://documents.rs-components.com/techlib://itc_doclist_GB.htm?stockno=6185129&src-supplier=RSComponents; ComponentLink3URL: https://www.verical.com/server-webapp/html/getDatasheet?partID=330685&src-supplier=Verical; ComponentLink3Description: https://www.verical.com/server-webapp/html/getDatasheet?partID=330685&src-supplier=Verical; Supplier 2: Mouser; Supplier Part Number 2: 603-RC0805JR-070RL; Stock 2: 658275; Pricing 2: 1=0.1, 10=0.005, 100=0.005, 1000=0.005, 5000=0.004, 10000=0.004 (USD); Manufacturer Part Number: RC0805JR-070RL
R2-R5 R7-R12 = R10k_1%_1/8W_0805: RES 10K OHM 1/8W 1%  0805; Partnumber: CRCW080510K0FKEA; Manufacturer: Vishay; Power Rating: 125mW; Resistance: 10kR; Temperature Coefficient: 100ppm/°C; Voltage Rating (DC): 150V; NCM: 8533.21.20; Case/Package: 0805; Case Code (Imperial): 0805; Case Code (Metric): 2012; ComponentLink1Description: https://www.digikey.com/product-detail/en/vishay-dale/CRCW080510K0FKEA/541-10-0KCCT-ND/1180897; ComponentLink1URL: https://www.digikey.com/product-detail/en/vishay-dale/CRCW080510K0FKEA/541-10-0KCCT-ND/1180897; ComponentLink2Description: https://br.mouser.com/ProductDetail/Vishay-Dale/CRCW080510K0FKEA?qs=sGAEpiMZZMu61qfTUdNhG2DpbjADlD3GOIdKSeOTyFU%3D; ComponentLink2URL: https://br.mouser.com/ProductDetail/Vishay-Dale/CRCW080510K0FKEA?qs=sGAEpiMZZMu61qfTUdNhG2DpbjADlD3GOIdKSeOTyFU%3D; ComponentLink3Description: http://www.mouser.com/ds/2/427/dcrcwe3-109170.pdf?src-supplier=Mouser; ComponentLink3URL: http://www.mouser.com/ds/2/427/dcrcwe3-109170.pdf?src-supplier=Mouser; ComponentLink4Description: http://uk.rs-online.com/webdocs/0d98/0900766b80d98b26.pdf?src-supplier=RSComponents; ComponentLink4URL: http://uk.rs-online.com/webdocs/0d98/0900766b80d98b26.pdf?src-supplier=RSComponents; ComponentLink5Description: http://www.alliedelec.com/m/d/0c934d6939ccefa68dbe0b96d821c8cf.pdf?src-supplier=Allied+Electronics; ComponentLink5URL: http://www.alliedelec.com/m/d/0c934d6939ccefa68dbe0b96d821c8cf.pdf?src-supplier=Allied+Electronics; ComponentLink6Description: http://www.vishay.com/docs/20035/dcrcwe3.pdf?src-supplier=Avnet+Asia; ComponentLink6URL: http://www.vishay.com/docs/20035/dcrcwe3.pdf?src-supplier=Avnet+Asia; ComponentLink7Description: http://www.vishay.com/docs/20035/dcrcwe3.pdf?src-supplier=Avnet+Europe; ComponentLink7URL: http://www.vishay.com/docs/20035/dcrcwe3.pdf?src-supplier=Avnet+Europe; ComponentLink8Description: http://www.farnell.com/datasheets/2310790.pdf?src-supplier=Element14; ComponentLink8URL: http://www.farnell.com/datasheets/2310790.pdf?src-supplier=Element14; ComponentLink9Description: http://www.vishay.com/docs/20035/dcrcwe3.pdf?src-supplier=Avnet; ComponentLink9URL: http://www.vishay.com/docs/20035/dcrcwe3.pdf?src-supplier=Avnet; ComponentLink10Description: http://www.vishay.com/docs/20035/dcrcwe3.pdf?src-supplier=Future+Electronics; ComponentLink10URL: http://www.vishay.com/docs/20035/dcrcwe3.pdf?src-supplier=Future+Electronics; Composition: Thick Film; Contact Plating: Tin; Depth: 1.25mm; Height: 0.45mm; Lead Free: Lead Free; Length: 2mm; Manufacturer Part Number: CRCW080510K0FKEA; Max Operating Temperature: 155°C; Military Standard: Not; Min Operating Temperature: -55°C; Package Quantity: 5000; Packaging: Tape and Reel; Pricing 1: 1=0.1, 10=0.062, 100=0.0254, 1000=0.01142, 2500=0.00991 (USD); Pricing 2: 1=0.1, 10=0.062, 100=0.025, 1000=0.01, 5000=0.007, 10000=0.006 (USD); Radiation Hardening: No; REACH SVHC: Unknown; Stock 1: 1478098; Stock 2: 157494; Supplier 1: Digi-Key; Supplier 2: Mouser; Supplier Part Number 1: 541-10.0KCCT-ND; Supplier Part Number 2: 71-CRCW0805-10K-E3; Termination: SMD/SMT; Tolerance: 1%; Voltage Rating: 150V; Weight: 0.000194oz; Width: 1.25mm
R6 = R100k_1%_1/8W_0805: RES 100K OHM 1/8W 1% 0805; Partnumber: AC0805FR-13100KL; Manufacturer: Yageo; Manufacturer Part Number: RC0805FR-07100KL; Max Power Dissipation: 125mW; Resistance: 100kR; Temperature Coefficient: 100ppm/°C; Voltage Rating (DC): 150V; NCM: 8533.21.20; Case/Package: 0805; Case Code (Imperial): 0805; Case Code (Metric): 2012; ComponentLink1Description: https://www.digikey.com/product-detail/en/yageo/RC0805FR-07100KL/311-100KCRCT-ND/730491; ComponentLink1URL: https://www.digikey.com/product-detail/en/yageo/RC0805FR-07100KL/311-100KCRCT-ND/730491; ComponentLink2Description: https://br.mouser.com/ProductDetail/Yageo/RC0805FR-07100KL?qs=%2Fha2pyFadugqH4HCO4lefXR2vnSIcQedeLFD%252BIWbuSwm%252BtiKkObUBg%3D%3D; ComponentLink2URL: https://br.mouser.com/ProductDetail/Yageo/RC0805FR-07100KL?qs=%2Fha2pyFadugqH4HCO4lefXR2vnSIcQedeLFD%252BIWbuSwm%252BtiKkObUBg%3D%3D; ComponentLink3Description: http://www.yageo.com/documents/recent/PYu-RC_Group_51_RoHS_L_10.pdf?src-supplier=Digi-Key; ComponentLink3URL: http://www.yageo.com/documents/recent/PYu-RC_Group_51_RoHS_L_10.pdf?src-supplier=Digi-Key; ComponentLink4Description: http://www.yageo.com/documents/recent/PYu-RC_Group_51_RoHS_L_9.pdf?src-supplier=Mouser; ComponentLink4URL: http://www.yageo.com/documents/recent/PYu-RC_Group_51_RoHS_L_9.pdf?src-supplier=Mouser; ComponentLink5Description: http://documents.rs-components.com/techlib://itc_doclist_GB.htm?stockno=6185113&src-supplier=RSComponents; ComponentLink5URL: http://documents.rs-components.com/techlib://itc_doclist_GB.htm?stockno=6185113&src-supplier=RSComponents; ComponentLink6Description: http://www.yageo.ru/pdf/RC0805.pdf?src-supplier=Future+Electronics; ComponentLink6URL: http://www.yageo.ru/pdf/RC0805.pdf?src-supplier=Future+Electronics; ComponentLink7Description: http://www.farnell.com/datasheets/38627.pdf?src-supplier=Element14; ComponentLink7URL: http://www.farnell.com/datasheets/38627.pdf?src-supplier=Element14; ComponentLink8Description: http://www.farnell.com/datasheets/2167052.pdf?src-supplier=Element14; ComponentLink8URL: http://www.farnell.com/datasheets/2167052.pdf?src-supplier=Element14; ComponentLink9Description: http://www.farnell.com/datasheets/1686128.pdf?src-supplier=Element14; ComponentLink9URL: http://www.farnell.com/datasheets/1686128.pdf?src-supplier=Element14; ComponentLink10Description: http://www.farnell.com/datasheets/444164.pdf?src-supplier=Element14; ComponentLink10URL: http://www.farnell.com/datasheets/444164.pdf?src-supplier=Element14; Composition: Thick Film; Depth: 1.25mm; Features: Moisture Resistant; Height: 0.024inch; Lead Free: Lead Free; Lead Pitch: 0.4mm; Length: 2mm; Max Operating Temperature: 155°C; Military Standard: Not; Min Operating Temperature: -55°C; Number of Pins: 2; Number of Terminations: 2; Package Quantity: 1; Packaging: Tape and Reel; Power Rating: 125mW; Pricing 1: 1=0.1, 10=0.04, 100=0.0163, 1000=0.00731, 2500=0.00635 (USD); Pricing 2: 1=0.13, 10=0.031, 100=0.011, 1000=0.008, 5000=0.005, 10000=0.005 (USD); REACH SVHC: Unknown; Stock 1: 5685931; Stock 2: 2067874; Supplier 1: Digi-Key; Supplier 2: Mouser; Supplier Part Number 1: 311-100KCRCT-ND; Supplier Part Number 2: 603-RC0805FR-07100KL; Termination: SMD/SMT; Tolerance: 1%; Voltage Rating: 150V; Width: 0.049inch
SC1 = 503182-1852: MOLEX - 503182-1852 - Micro SD Normal UltraLowPro8CktEmbsTpPkg RoHS Compliant: Yes; Gender: Male; Number of Circuits: 8; Pitch: 1.1mm; Supplier 1: Digi-Key; Supplier Part Number 1: WM12834CT-ND; Manufacturer: Molex; Stock 1: 15724; Pricing 1: 1=2.45, 10=2.224, 25=2.0884, 50=1.9974, 100=1.9067, 250=1.72508, 500=1.5889 (USD); Mount: Surface Mount; Contact Material: Copper Alloy; Contact Plating: Gold; Housing Material: Polymer; Min Operating Temperature: -25°C; Max Operating Temperature: 85°C; Number of Rows: 1; Package Quantity: 1600; Packaging: Tape and Reel; Connector Type: Connector; Termination: Solder; Orientation: Right Angle; Length: 15.2mm; Depth: 14.95mm; REACH SVHC: No SVHC; Halogen Free: Low Halogen; ComponentLink1URL: https://www.molex.com/pdm_docs/sd/5031821852_sd.pdf?src-supplier=Digi-Key; ComponentLink1Description: https://www.molex.com/pdm_docs/sd/5031821852_sd.pdf?src-supplier=Digi-Key; ComponentLink2URL: http://www.farnell.com/datasheets/2701359.pdf?src-supplier=Element14; ComponentLink2Description: http://www.farnell.com/datasheets/2701359.pdf?src-supplier=Element14; ComponentLink3URL: http://www.farnell.com/datasheets/2701359.pdf?src-supplier=Farnell; ComponentLink3Description: http://www.farnell.com/datasheets/2701359.pdf?src-supplier=Farnell; ComponentLink4URL: http://www.molex.com/pdm_docs/sd/5031821852_sd.pdf?src-supplier=Digi-Key; ComponentLink4Description: http://www.molex.com/pdm_docs/sd/5031821852_sd.pdf?src-supplier=Digi-Key; ComponentLink5URL: http://components.arrow.com/part/dataview/0323_07103516?src-supplier=Arrow+Europe; ComponentLink5Description: http://components.arrow.com/part/dataview/0323_07103516?src-supplier=Arrow+Europe; ComponentLink6URL: http://www.farnell.com/datasheets/2701359.pdf?src-supplier=Newark; ComponentLink6Description: http://www.farnell.com/datasheets/2701359.pdf?src-supplier=Newark; Supplier 2: Mouser; Supplier Part Number 2: 538-503182-1852; Stock 2: 10562; Pricing 2: 1=2.22, 10=1.81, 100=1.56, 500=1.44, 1000=1.23, 1600=1.15, 4800=1.07, 9600=1.03, 24000=1 (USD); Manufacturer Part Number: 503182-1852
TP1-TP6 = TEST_POINT_2: Test point
U1 = MT25QL01GBBB8ESF-0SIT (2): NOR Flash Serial-SPI 3V 1Gbit 1024M/512M/256M x 1bit/2bit/4bit 6ns 16-Pin SOP-II; Manufacturer: Micron Technology; Interface: SPI,Serial; Min Supply Voltage: 2.7V; Density: 1Gb; Max Supply Voltage: 3.6V; Page Size: 256B; Supplier 1: Digi-Key; Supplier Part Number 1: 557-1789-ND; Stock 1: 1351; Pricing 1: 1=10.53, 10=9.755, 25=9.534, 50=9.4818, 100=8.3474, 250=7.9344, 500=7.85296, 1000=7.59119 (USD); Mount: Surface Mount; Case/Package: SOP; Number of Pins: 16; Contact Plating: Tin,Matte; Min Operating Temperature: -40°C; Max Operating Temperature: 85°C; Memory Type: NOR; Operating Supply Voltage: 3V; Access Time: 6ns; ComponentLink1URL: https://www.micron.com/~/media/documents/products/data-sheet/nor-flash/serial-nor/mt25q/die-rev-b/mt25q_qlkt_l_01g_bbb_0.pdf?src-supplier=Digi-Key; ComponentLink1Description: https://www.micron.com/~/media/documents/products/data-sheet/nor-flash/serial-nor/mt25q/die-rev-b/mt25q_qlkt_l_01g_bbb_0.pdf?src-supplier=Digi-Key; ComponentLink2URL: http://www.micron.com/~/media/documents/products/data-sheet/nor-flash/serial-nor/mt25q/mt25q_qlkt_l_01g_bbb_0.pdf?src-supplier=Avnet+Asia; ComponentLink2Description: http://www.micron.com/~/media/documents/products/data-sheet/nor-flash/serial-nor/mt25q/mt25q_qlkt_l_01g_bbb_0.pdf?src-supplier=Avnet+Asia; Supplier 2: Mouser; Supplier Part Number 2: 340-278808-TRAY; Stock 2: 2389; Pricing 2: 1=12, 10=11.04, 25=10.81, 50=10.77, 100=9.67, 250=9.37, 500=8.91, 1000=8.6, 2000=7.97 (USD); Manufacturer Part Number: MT25QL01GBBB8ESF-0SIT

## Sheet 3_Communication_Buffers.SchDoc
size A4; Organization: SpaceLab UFSC; Address1: UFSC - SpaceLab; Address2: University Campus - Trindade; Address3: Dep. of Electrical Engineering - CTC; Address4: Florianópolis, Santa Catarina, Brazil; DocumentNumber: 4; SheetNumber: 4; SheetTotal: 4; Address5: CEP: 88040 - 900
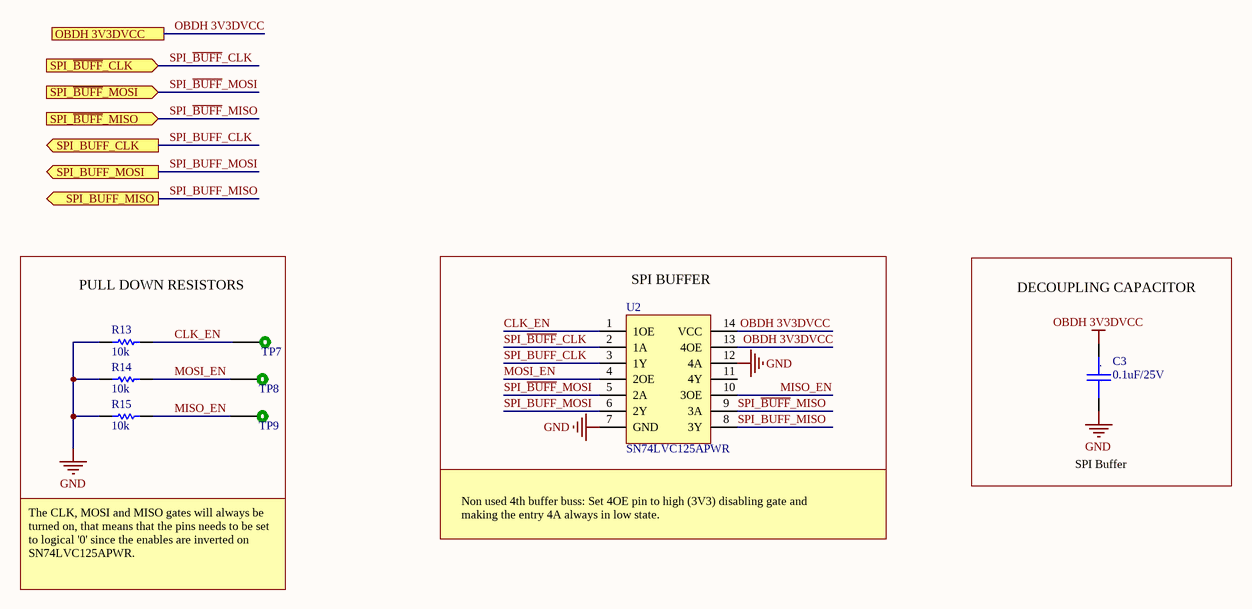
[diagram p3: 3_Communication_Buffers.SchDoc]

### Parts
C3  0.1uF/25V  [C0805_MD]
R13  10k  [0805]
R14  10k  [0805]
R15  10k  [0805]
TP7  TEST_POINT_2  [TEST_POINT_2]  (value not drawn)  (no BOM)
TP8  TEST_POINT_2  [TEST_POINT_2]  (value not drawn)  (no BOM)
TP9  TEST_POINT_2  [TEST_POINT_2]  (value not drawn)  (no BOM)
U2  SN74LVC125APWR  [SN74LVC125APWR]

### Blocks framed on the sheet
PULL DOWN RESISTORS: R13-R15 TP7-TP9
SPI BUFFER: U2
DECOUPLING CAPACITOR: C3

### Ports
OBDH 3V3DVCC, SPI_BUFF_CLK (out), SPI_BUFF_MISO (out), SPI_BUFF_MOSI (out), SPI_~{BUFF}_CLK (in), SPI_~{BUFF}_MISO (in), SPI_~{BUFF}_MOSI (in)

### Nets
GND: C3.2 R13.2 R14.2 R15.2 U2.7(GND) U2.12(4A)
OBDH 3V3DVCC: C3.1 U2.13(4OE) U2.14(VCC) ; port OBDH 3V3DVCC
CLK_EN: R13.1 TP7.1 U2.1(1OE)
MISO_EN: R15.1 TP9.1 U2.10(3OE)
MOSI_EN: R14.1 TP8.1 U2.4(2OE)
SPI_~{BUFF}_CLK: U2.2(1A) ; port SPI_~{BUFF}_CLK  [project net SPI CLK]
SPI_~{BUFF}_MISO: U2.9(3A) ; port SPI_~{BUFF}_MISO  [project net SPI MISO]
SPI_~{BUFF}_MOSI: U2.5(2A) ; port SPI_~{BUFF}_MOSI  [project net SPI MOSI]
SPI_BUFF_CLK: U2.3(1Y) ; port SPI_BUFF_CLK
SPI_BUFF_MISO: U2.8(3Y) ; port SPI_BUFF_MISO
SPI_BUFF_MOSI: U2.6(2Y) ; port SPI_BUFF_MOSI

Not connected (* = marked no-connect by the designer): U2 11(4Y)

### Notes on the sheet
- SPI Buffer
- The CLK, MOSI and MISO gates will always be turned on, that means that the pins needs to be set to logical '0' since the enables are inverted on SN74LVC125APWR.
- Non used 4th buffer buss: Set 4OE pin to high (3V3) disabling gate and making the entry 4A always in low state.
- Date:
- Title:
- Size:
- A4
- Project:
- Time:
- Sheet
- of
- Revision:
- UFSC - SpaceLab
- University Campus - Trindade
- Dep. of Electrical Engineering - CTC
- Florianópolis, Santa Catarina, Brazil
- CEP: 88040 - 900
- Drawn By:
- Model:
- (in symbol Cap_Cer_X7R_0.1uF_25V_0805) .

### Library data of the parts
C3 = Cap_Cer_X7R_0.1uF_25V_0805: CAP CER 0.1UF 25V 10% X7R 0805; Partnumber: CC0805KRX7R8BB104; Manufacturer: Yageo; Capacitance: 100nF; Insulation Resistance: 100GR; Material: Ceramic; NCM: 8532.24.10; Case/Package: 0805; Case Code (Imperial): 0805; Case Code (Metric): 2012; ComponentLink1Description: http://www.yageo.com/documents/recent/UPY-GPHC_X7R_6.3V-to-50V_18.pdf?src-supplier=Digi-Key; ComponentLink1URL: http://www.yageo.com/documents/recent/UPY-GPHC_X7R_6.3V-to-50V_18.pdf?src-supplier=Digi-Key; ComponentLink2Description: http://www.farnell.com/datasheets/1489800.pdf?src-supplier=Element14; ComponentLink2URL: http://www.farnell.com/datasheets/1489800.pdf?src-supplier=Element14; ComponentLink3Description: http://www.yageo.com/documents/recent/UPY-GPHC_X7R_6.3V-to-50V_18.pdf?src-supplier=Digi-Key; ComponentLink3URL: http://www.yageo.com/documents/recent/UPY-GPHC_X7R_6.3V-to-50V_18.pdf?src-supplier=Digi-Key; ComponentLink4Description: http://www.farnell.com/datasheets/1489800.pdf?src-supplier=Element14; ComponentLink4URL: http://www.farnell.com/datasheets/1489800.pdf?src-supplier=Element14; ComponentLink5Description: http://www.farnell.com/datasheets/1850775.pdf?src-supplier=Element14; ComponentLink5URL: http://www.farnell.com/datasheets/1850775.pdf?src-supplier=Element14; ComponentLink6Description: https://www.verical.com/server-webapp/html/getDatasheet?partID=330244&src-supplier=Verical; ComponentLink6URL: https://www.verical.com/server-webapp/html/getDatasheet?partID=330244&src-supplier=Verical; ComponentLink7Description: http://www.yageo.com/documents/recent/UPY-GPHC_X7R_6.3V-to-50V_8.pdf?src-supplier=Avnet+Europe; ComponentLink7URL: http://www.yageo.com/documents/recent/UPY-GPHC_X7R_6.3V-to-50V_8.pdf?src-supplier=Avnet+Europe; ComponentLink8Description: http://www.farnell.com/datasheets/1784427.pdf?src-supplier=Element14; ComponentLink8URL: http://www.farnell.com/datasheets/1784427.pdf?src-supplier=Element14; ComponentLink9Description: http://www.farnell.com/datasheets/70765.pdf?src-supplier=Element14; ComponentLink9URL: http://www.farnell.com/datasheets/70765.pdf?src-supplier=Element14; Composition: Ceramic; Depth: 1.25mm; Dielectric: X7R; Halogen Free: Halogen Free; Height: 0.85mm; Lead Free: Lead Free; Length: 2mm; Manufacturer Part Number: CC0805KRX7R8BB104; Max Operating Temperature: 125°C; Min Operating Temperature: -55°C; Mount: Surface Mount; Number of Pins: 2; Package Quantity: 1; Packaging: Tape and Reel; Pricing 1: 1=0.14, 10=0.097, 100=0.0458, 500=0.0321, 1000=0.02658 (USD); Pricing 2: 1=0.11, 10=0.08, 100=0.03, 1000=0.025, 4000=0.019, 8000=0.018, 24000=0.015, 48000=0.014, 100000=0.013 (USD); Radiation Hardening: No; REACH SVHC: No SVHC; Stock 1: 243958; Stock 2: 131050; Supplier 1: Digi-Key; Supplier 2: Mouser; Supplier Part Number 1: 311-1141-1-ND; Supplier Part Number 2: 603-CC805KRX7R8BB104; Termination: SMD/SMT; Thickness: 0.033inch; Tolerance: 10%; Voltage Rating (DC): 25V; Voltage Rating: 25V; Width: 0.049inch
R13-R15 = R10k_1%_1/8W_0805: as R2 on sheet 2_Non_Volatile_Memories; NCM: 8533.21.20; Case/Package: 0805; Case Code (Imperial): 0805; Case Code (Metric): 2012; ComponentLink1Description: https://www.digikey.com/product-detail/en/vishay-dale/CRCW080510K0FKEA/541-10-0KCCT-ND/1180897; ComponentLink1URL: https://www.digikey.com/product-detail/en/vishay-dale/CRCW080510K0FKEA/541-10-0KCCT-ND/1180897; ComponentLink2Description: https://br.mouser.com/ProductDetail/Vishay-Dale/CRCW080510K0FKEA?qs=sGAEpiMZZMu61qfTUdNhG2DpbjADlD3GOIdKSeOTyFU%3D; ComponentLink2URL: https://br.mouser.com/ProductDetail/Vishay-Dale/CRCW080510K0FKEA?qs=sGAEpiMZZMu61qfTUdNhG2DpbjADlD3GOIdKSeOTyFU%3D; ComponentLink3Description: http://www.mouser.com/ds/2/427/dcrcwe3-109170.pdf?src-supplier=Mouser; ComponentLink3URL: http://www.mouser.com/ds/2/427/dcrcwe3-109170.pdf?src-supplier=Mouser; ComponentLink4Description: http://uk.rs-online.com/webdocs/0d98/0900766b80d98b26.pdf?src-supplier=RSComponents; ComponentLink4URL: http://uk.rs-online.com/webdocs/0d98/0900766b80d98b26.pdf?src-supplier=RSComponents; ComponentLink5Description: http://www.alliedelec.com/m/d/0c934d6939ccefa68dbe0b96d821c8cf.pdf?src-supplier=Allied+Electronics; ComponentLink5URL: http://www.alliedelec.com/m/d/0c934d6939ccefa68dbe0b96d821c8cf.pdf?src-supplier=Allied+Electronics; ComponentLink6Description: http://www.vishay.com/docs/20035/dcrcwe3.pdf?src-supplier=Avnet+Asia; ComponentLink6URL: http://www.vishay.com/docs/20035/dcrcwe3.pdf?src-supplier=Avnet+Asia; ComponentLink7Description: http://www.vishay.com/docs/20035/dcrcwe3.pdf?src-supplier=Avnet+Europe; ComponentLink7URL: http://www.vishay.com/docs/20035/dcrcwe3.pdf?src-supplier=Avnet+Europe; ComponentLink8Description: http://www.farnell.com/datasheets/2310790.pdf?src-supplier=Element14; ComponentLink8URL: http://www.farnell.com/datasheets/2310790.pdf?src-supplier=Element14; ComponentLink9Description: http://www.vishay.com/docs/20035/dcrcwe3.pdf?src-supplier=Avnet; ComponentLink9URL: http://www.vishay.com/docs/20035/dcrcwe3.pdf?src-supplier=Avnet; ComponentLink10Description: http://www.vishay.com/docs/20035/dcrcwe3.pdf?src-supplier=Future+Electronics; ComponentLink10URL: http://www.vishay.com/docs/20035/dcrcwe3.pdf?src-supplier=Future+Electronics; Composition: Thick Film; Contact Plating: Tin; Depth: 1.25mm; Height: 0.45mm; Lead Free: Lead Free; Length: 2mm; Manufacturer Part Number: CRCW080510K0FKEA; Max Operating Temperature: 155°C; Military Standard: Not; Min Operating Temperature: -55°C; Package Quantity: 5000; Packaging: Tape and Reel; Pricing 1: 1=0.1, 10=0.062, 100=0.0254, 1000=0.01142, 2500=0.00991 (USD); Pricing 2: 1=0.1, 10=0.062, 100=0.025, 1000=0.01, 5000=0.007, 10000=0.006 (USD); Radiation Hardening: No; REACH SVHC: Unknown; Stock 1: 1478098; Stock 2: 157494; Supplier 1: Digi-Key; Supplier 2: Mouser; Supplier Part Number 1: 541-10.0KCCT-ND; Supplier Part Number 2: 71-CRCW0805-10K-E3; Termination: SMD/SMT; Tolerance: 1%; Voltage Rating: 150V; Weight: 0.000194oz; Width: 1.25mm
TP7-TP9 = TEST_POINT_2: Test point
U2 = SN74LVC125APWR: IC BUF NON-INVERT 3.6V 14TSSOP; Manufacturer: Texas Instruments; Number of Inputs: 4; Min Supply Voltage: 1.65V; Logic Function: Buffer,Inverting; Max Power Dissipation: 500mW; Propagation Delay: 4.6ns; Number of Bits per Element: 1; High Level Output Current: -24mA; Low Level Output Current: 24mA; Number of Output Lines: 3; Polarity: Non-Inverting; Turn-On Delay Time: 5.3ns; Quiescent Current: 1uA; Supplier 1: Digi-Key; Manufacturer Part Number: SN74LVC125APWR; Stock 1: 51249; Pricing 1: 1=0.35, 10=0.282, 25=0.258, 100=0.192, 250=0.174, 500=0.144, 1000=0.108 (USD); Mount: Surface Mount; Case/Package: TSSOP; Number of Pins: 14; Contact Plating: Gold; Min Operating Temperature: -40°C; Max Operating Temperature: 125°C; Package Quantity: 1; Number of Elements: 4; Packaging: Tape and Reel; Max Supply Voltage: 3.6V; Number of Channels: 4; Number of Outputs: 4; Number of Input Lines: 4; Number of Bits: 4; Termination: SMD/SMT; Number of Circuits: 4; Number of Gates: 4; Length: 5mm; Height: 1.15mm; Width: 4.4mm; Radiation Hardening: No; REACH SVHC: No SVHC; Lead Free: Lead Free; ComponentLink1URL: https://www.digikey.com/product-detail/en/texas-instruments/SN74LVC125APWR/296-1222-1-ND/276490; ComponentLink1Description: https://www.digikey.com/product-detail/en/texas-instruments/SN74LVC125APWR/296-1222-1-ND/276490; ComponentLink2URL: https://br.mouser.com/ProductDetail/Texas-Instruments/SN74LVC125APWR?qs=sGAEpiMZZMuiiWkaIwCK2SeqB8b8eM7HVlo3jiw3ikc%3D; ComponentLink2Description: https://br.mouser.com/ProductDetail/Texas-Instruments/SN74LVC125APWR?qs=sGAEpiMZZMuiiWkaIwCK2SeqB8b8eM7HVlo3jiw3ikc%3D; ComponentLink3URL: http://www.ti.com/lit/ds/symlink/sn74lvc125a.pdf?src-supplier=Digi-Key; ComponentLink3Description: http://www.ti.com/lit/ds/symlink/sn74lvc125a.pdf?src-supplier=Digi-Key; ComponentLink4URL: http://www.ti.com/general/docs/lit/getliterature.tsp?genericPartNumber=SN74LVC125A&&fileType=pdf&src-supplier=Avnet; ComponentLink4Description: http://www.ti.com/general/docs/lit/getliterature.tsp?genericPartNumber=SN74LVC125A&&fileType=pdf&src-supplier=Avnet; Supplier Part Number 1: 296-1222-1-ND; ComponentLink5Description: http://www.farnell.com/datasheets/1764352.pdf?src-supplier=Element14; ComponentLink5URL: http://www.farnell.com/datasheets/1764352.pdf?src-supplier=Element14; ComponentLink6Description: http://www.produktinfo.conrad.com/datenblaetter/1000000-1099999/001017107-da-01-en-IC_BUS_BUF_Q_SN74LVC125APWR_TSSOP_14_TID.pdf?src-supplier=Conrad; ComponentLink6URL: http://www.produktinfo.conrad.com/datenblaetter/1000000-1099999/001017107-da-01-en-IC_BUS_BUF_Q_SN74LVC125APWR_TSSOP_14_TID.pdf?src-supplier=Conrad; Pricing 2: 1=0.34, 10=0.265, 100=0.143, 1000=0.107, 2000=0.092, 10000=0.086 (USD); Stock 2: 22689; Supplier 2: Mouser; Supplier Part Number 2: 595-SN74LVC125APWR